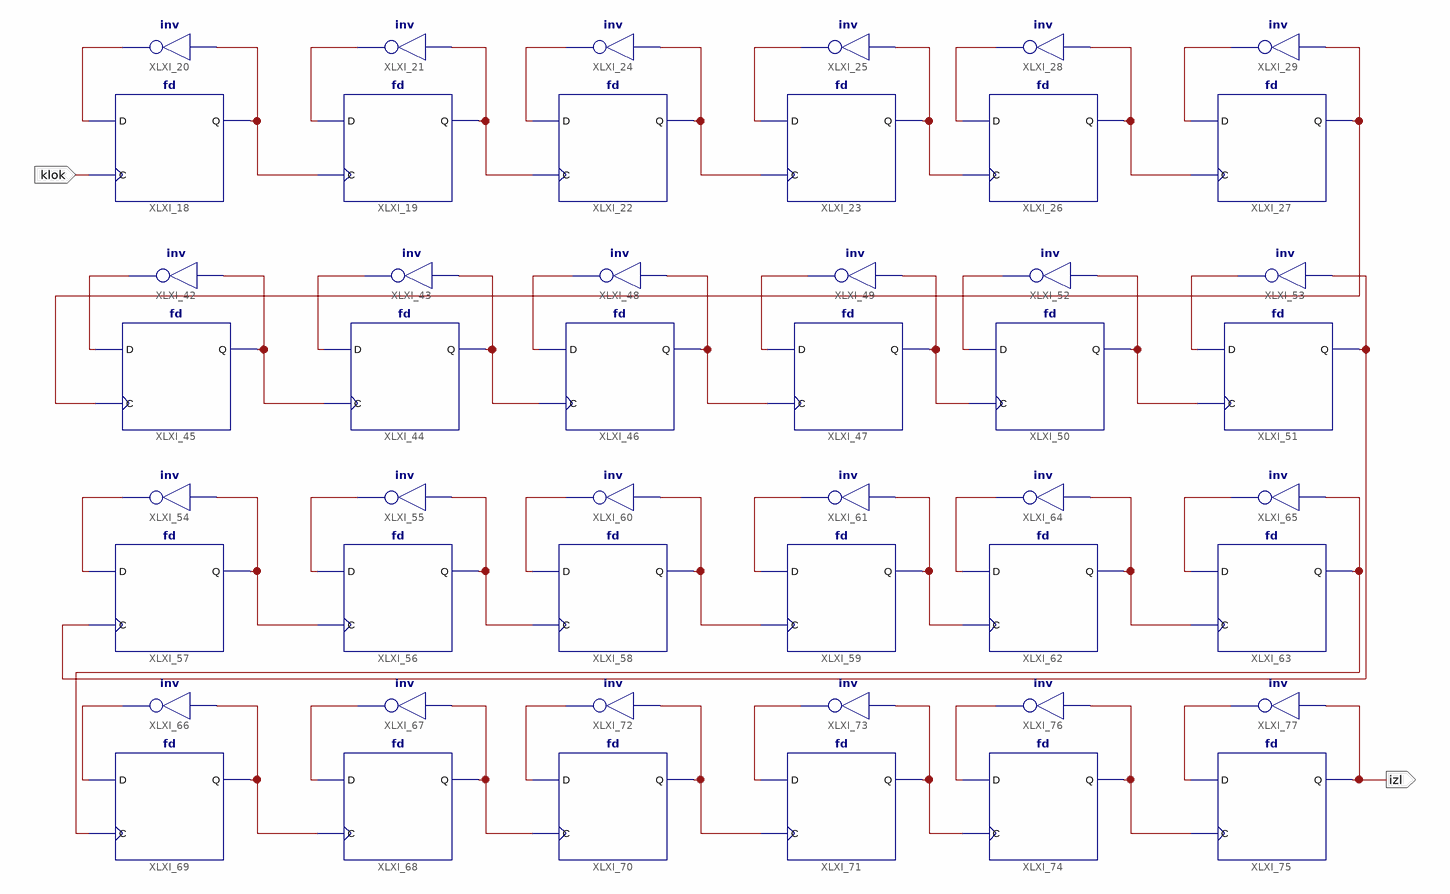
[diagram p0: schematic sheet 1]
// Xilinx ISE schematic usporavanje.sch (spartan3e) as structural Verilog: 48 symbols, 2 ports
module usporavanje (
  input  klok,
  output izl
);

  wire XLXN_19, XLXN_20, XLXN_22, XLXN_23, XLXN_24, XLXN_25, XLXN_26, XLXN_27, XLXN_28, XLXN_29, XLXN_30,
       XLXN_31, XLXN_64, XLXN_65, XLXN_66, XLXN_67, XLXN_68, XLXN_69, XLXN_70, XLXN_71, XLXN_72, XLXN_73,
       XLXN_74, XLXN_75, XLXN_76, XLXN_77, XLXN_78, XLXN_79, XLXN_80, XLXN_81, XLXN_82, XLXN_83, XLXN_84,
       XLXN_85, XLXN_86, XLXN_87, XLXN_88, XLXN_89, XLXN_90, XLXN_91, XLXN_92, XLXN_93, XLXN_94, XLXN_95,
       XLXN_96, XLXN_97, XLXN_98;

  not XLXI_20 (XLXN_19, XLXN_20);
  not XLXI_21 (XLXN_22, XLXN_23);
  fd XLXI_19 (.C(XLXN_20), .D(XLXN_22), .Q(XLXN_23));
  fd XLXI_18 (.C(klok), .D(XLXN_19), .Q(XLXN_20));
  fd XLXI_22 (.C(XLXN_23), .D(XLXN_24), .Q(XLXN_25));
  fd XLXI_23 (.C(XLXN_25), .D(XLXN_26), .Q(XLXN_27));
  not XLXI_24 (XLXN_24, XLXN_25);
  not XLXI_25 (XLXN_26, XLXN_27);
  fd XLXI_26 (.C(XLXN_27), .D(XLXN_28), .Q(XLXN_29));
  fd XLXI_27 (.C(XLXN_29), .D(XLXN_30), .Q(XLXN_31));
  not XLXI_28 (XLXN_28, XLXN_29);
  not XLXI_29 (XLXN_30, XLXN_31);
  not XLXI_42 (XLXN_67, XLXN_66);
  not XLXI_43 (XLXN_65, XLXN_64);
  fd XLXI_44 (.C(XLXN_66), .D(XLXN_65), .Q(XLXN_64));
  fd XLXI_45 (.C(XLXN_31), .D(XLXN_67), .Q(XLXN_66));
  fd XLXI_46 (.C(XLXN_64), .D(XLXN_68), .Q(XLXN_69));
  fd XLXI_47 (.C(XLXN_69), .D(XLXN_70), .Q(XLXN_71));
  not XLXI_48 (XLXN_68, XLXN_69);
  not XLXI_49 (XLXN_70, XLXN_71);
  fd XLXI_50 (.C(XLXN_71), .D(XLXN_72), .Q(XLXN_73));
  fd XLXI_51 (.C(XLXN_73), .D(XLXN_74), .Q(XLXN_75));
  not XLXI_52 (XLXN_72, XLXN_73);
  not XLXI_53 (XLXN_74, XLXN_75);
  not XLXI_54 (XLXN_79, XLXN_78);
  not XLXI_55 (XLXN_77, XLXN_76);
  fd XLXI_56 (.C(XLXN_78), .D(XLXN_77), .Q(XLXN_76));
  fd XLXI_57 (.C(XLXN_75), .D(XLXN_79), .Q(XLXN_78));
  fd XLXI_58 (.C(XLXN_76), .D(XLXN_80), .Q(XLXN_81));
  fd XLXI_59 (.C(XLXN_81), .D(XLXN_82), .Q(XLXN_83));
  not XLXI_60 (XLXN_80, XLXN_81);
  not XLXI_61 (XLXN_82, XLXN_83);
  fd XLXI_62 (.C(XLXN_83), .D(XLXN_84), .Q(XLXN_85));
  fd XLXI_63 (.C(XLXN_85), .D(XLXN_86), .Q(XLXN_87));
  not XLXI_64 (XLXN_84, XLXN_85);
  not XLXI_65 (XLXN_86, XLXN_87);
  not XLXI_66 (XLXN_91, XLXN_90);
  not XLXI_67 (XLXN_89, XLXN_88);
  fd XLXI_68 (.C(XLXN_90), .D(XLXN_89), .Q(XLXN_88));
  fd XLXI_69 (.C(XLXN_87), .D(XLXN_91), .Q(XLXN_90));
  fd XLXI_70 (.C(XLXN_88), .D(XLXN_92), .Q(XLXN_93));
  fd XLXI_71 (.C(XLXN_93), .D(XLXN_94), .Q(XLXN_95));
  not XLXI_72 (XLXN_92, XLXN_93);
  not XLXI_73 (XLXN_94, XLXN_95);
  fd XLXI_74 (.C(XLXN_95), .D(XLXN_96), .Q(XLXN_97));
  fd XLXI_75 (.C(XLXN_97), .D(XLXN_98), .Q(izl));
  not XLXI_76 (XLXN_96, XLXN_97);
  not XLXI_77 (XLXN_98, izl);
endmodule
